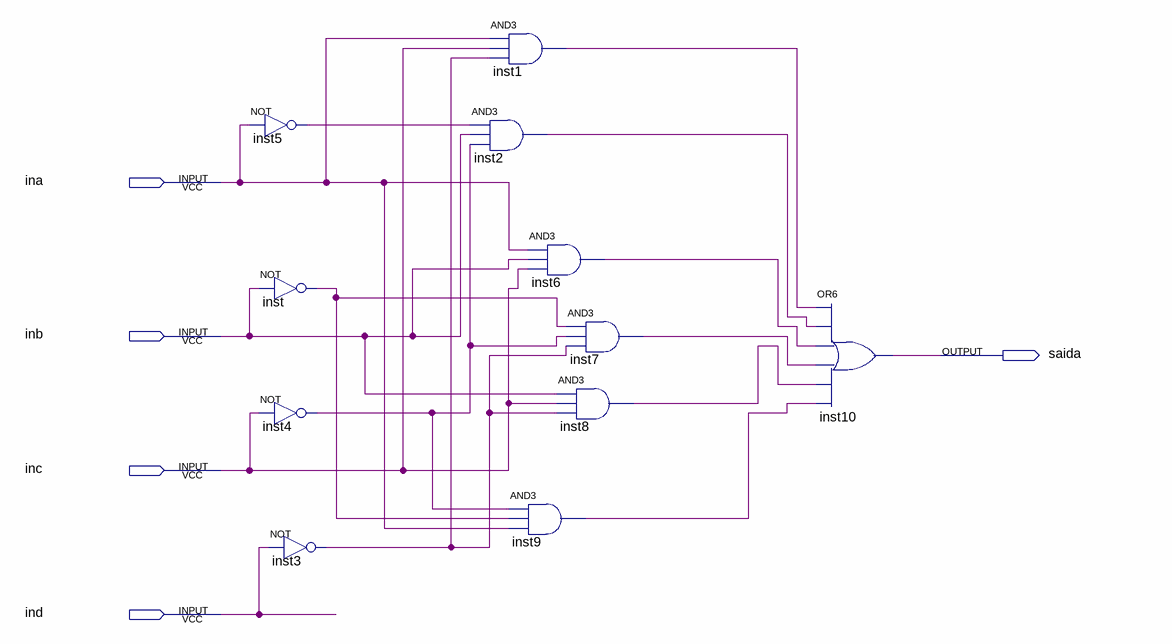
[diagram p0: schematic sheet]
// Quartus schematic f.bdf as structural Verilog: 11 symbols, 5 pins
module f (
  input  ina,
  input  inb,
  input  inc,
  input  ind,
  output saida
);

  wire inst1_out, inst2_out, inst3_out, inst4_out, inst5_out, inst6_out, inst7_out, inst8_out, inst9_out,
       inst_out;

  not inst5 (inst5_out, ina);
  not inst (inst_out, inb);
  not inst4 (inst4_out, inc);
  not inst3 (inst3_out, ind);
  and inst1 (inst1_out, ina, inc, inst3_out);
  and inst2 (inst2_out, inst5_out, inb, inst4_out);
  and inst9 (inst9_out, inst4_out, inst_out, ina);
  and inst6 (inst6_out, ina, inb, inc);
  and inst7 (inst7_out, inst_out, inst4_out, inst3_out);
  and inst8 (inst8_out, inb, inc, inst3_out);
  or inst10 (saida, inst1_out, inst2_out, inst6_out, inst7_out, inst8_out, inst9_out);
endmodule
